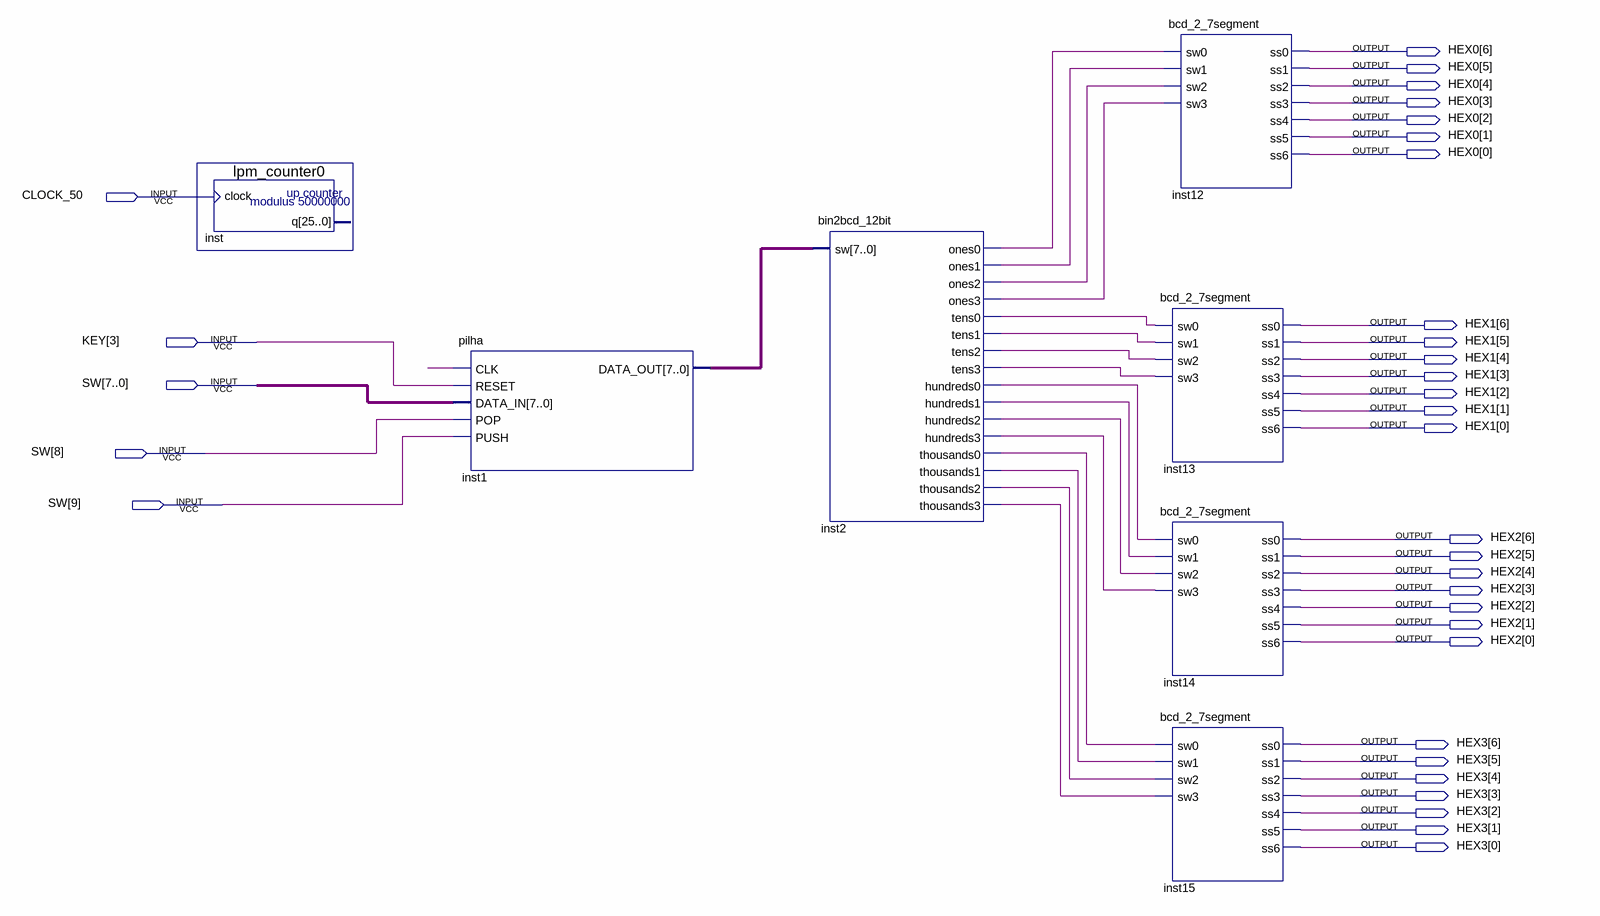
[diagram p0: schematic sheet]
// Quartus schematic bcd.bdf as structural Verilog: 7 symbols, 33 pins
module bcd (
  input  CLOCK_50,
  input  [3:3] KEY,
  input  [9:0] SW,
  output [6:0] HEX0,
  output [6:0] HEX1,
  output [6:0] HEX2,
  output [6:0] HEX3
);

  wire inst2_hundreds0, inst2_hundreds1, inst2_hundreds2, inst2_hundreds3, inst2_ones0, inst2_ones1,
       inst2_ones2, inst2_ones3, inst2_tens0, inst2_tens1, inst2_tens2, inst2_tens3, inst2_thousands0,
       inst2_thousands1, inst2_thousands2, inst2_thousands3, undriven;
  wire [7:0] inst1_data_out;

  lpm_counter0 inst (.clock(CLOCK_50));  // open: q
  pilha inst1 (.CLK(undriven), .RESET(KEY[3]), .DATA_IN(SW[7:0]), .POP(SW[8]), .PUSH(SW[9]), .DATA_OUT(inst1_data_out));
  bin2bcd_12bit inst2 (
    .sw(inst1_data_out), .ones0(inst2_ones0), .ones1(inst2_ones1), .ones2(inst2_ones2), .ones3(inst2_ones3),
    .tens0(inst2_tens0), .tens1(inst2_tens1), .tens2(inst2_tens2), .tens3(inst2_tens3),
    .hundreds0(inst2_hundreds0), .hundreds1(inst2_hundreds1), .hundreds2(inst2_hundreds2),
    .hundreds3(inst2_hundreds3), .thousands0(inst2_thousands0), .thousands1(inst2_thousands1),
    .thousands2(inst2_thousands2), .thousands3(inst2_thousands3));
  bcd_2_7segment inst12 (
    .sw0(inst2_ones0), .sw1(inst2_ones1), .sw2(inst2_ones2), .sw3(inst2_ones3), .ss0(HEX0[6]), .ss1(HEX0[5]),
    .ss2(HEX0[4]), .ss3(HEX0[3]), .ss4(HEX0[2]), .ss5(HEX0[1]), .ss6(HEX0[0]));
  bcd_2_7segment inst13 (
    .sw0(inst2_tens0), .sw1(inst2_tens1), .sw2(inst2_tens2), .sw3(inst2_tens3), .ss0(HEX1[6]), .ss1(HEX1[5]),
    .ss2(HEX1[4]), .ss3(HEX1[3]), .ss4(HEX1[2]), .ss5(HEX1[1]), .ss6(HEX1[0]));
  bcd_2_7segment inst14 (
    .sw0(inst2_hundreds0), .sw1(inst2_hundreds1), .sw2(inst2_hundreds2), .sw3(inst2_hundreds3),
    .ss0(HEX2[6]), .ss1(HEX2[5]), .ss2(HEX2[4]), .ss3(HEX2[3]), .ss4(HEX2[2]), .ss5(HEX2[1]), .ss6(HEX2[0]));
  bcd_2_7segment inst15 (
    .sw0(inst2_thousands0), .sw1(inst2_thousands1), .sw2(inst2_thousands2), .sw3(inst2_thousands3),
    .ss0(HEX3[6]), .ss1(HEX3[5]), .ss2(HEX3[4]), .ss3(HEX3[3]), .ss4(HEX3[2]), .ss5(HEX3[1]), .ss6(HEX3[0]));
endmodule
